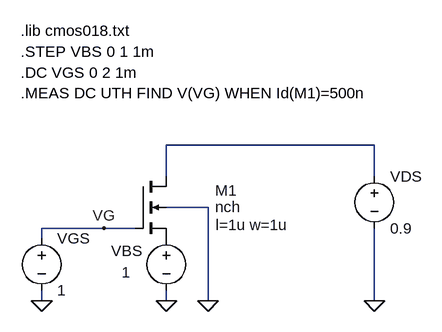
[diagram p0: schematic Draft3N.asc]
Draft3N.asc, the LTspice schematic file:
Version 4
SHEET 1 928 680
WIRE 576 64 256 64
WIRE 256 112 256 64
WIRE 576 112 576 64
WIRE 320 160 256 160
WIRE 160 192 64 192
WIRE 208 192 160 192
WIRE 64 208 64 192
WIRE 64 304 64 288
WIRE 256 304 256 288
WIRE 320 304 320 160
WIRE 576 304 576 192
FLAG 256 304 0
FLAG 576 304 0
FLAG 64 304 0
FLAG 160 192 VG
FLAG 320 304 0
SYMBOL nmos4 208 112 R0
WINDOW 0 123 22 Left 2
WINDOW 3 123 47 Left 2
WINDOW 123 124 75 Left 2
SYMATTR InstName M1
SYMATTR Value nch
SYMATTR Value2 l=1u w=1u
SYMBOL voltage 576 96 R0
WINDOW 123 0 0 Left 0
WINDOW 39 0 0 Left 0
SYMATTR InstName VDS
SYMATTR Value 0.9
SYMBOL voltage 64 192 R0
WINDOW 123 0 0 Left 0
WINDOW 39 0 0 Left 0
SYMATTR InstName VGS
SYMATTR Value 1
SYMBOL voltage 256 192 R0
WINDOW 0 -85 35 Left 2
WINDOW 3 -69 68 Left 2
WINDOW 123 0 0 Left 0
WINDOW 39 0 0 Left 0
SYMATTR InstName VBS
SYMATTR Value 1
TEXT 32 -112 Left 2 !.lib cmos018.txt
TEXT 32 -80 Left 2 !.STEP VBS 0 1 1m
TEXT 32 -16 Left 2 !.MEAS DC UTH FIND V(VG) WHEN Id(M1)=500n
TEXT 32 -48 Left 2 !.DC VGS 0 2 1m

The netlist it stands for:
* Draft3N.asc
M1 N001 VG P001 0 nch l=1u w=1u
VDS N001 0 0.9
VGS VG 0 1
VBS P001 0 1
.model NMOS NMOS
.model PMOS PMOS
.lib standard.mos
.lib cmos018.txt
.STEP VBS 0 1 1m
.MEAS DC UTH FIND V(VG) WHEN Id(M1)=500n
.DC VGS 0 2 1m
.backanno
.end